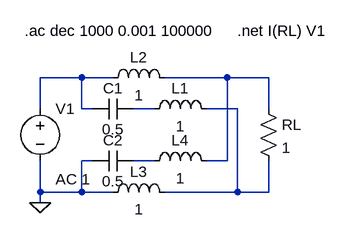
[diagram p0: schematic EJ1.asc]
EJ1.asc, the LTspice schematic file:
Version 4
SHEET 1 880 680
WIRE 96 192 32 192
WIRE 144 192 96 192
WIRE 320 192 224 192
WIRE 384 192 320 192
WIRE 32 240 32 192
WIRE 96 240 96 192
WIRE 112 240 96 240
WIRE 208 240 176 240
WIRE 336 240 288 240
WIRE 384 240 384 192
WIRE 112 320 96 320
WIRE 208 320 176 320
WIRE 320 320 320 192
WIRE 320 320 288 320
WIRE 32 368 32 320
WIRE 96 368 96 320
WIRE 96 368 32 368
WIRE 144 368 96 368
WIRE 336 368 336 240
WIRE 336 368 224 368
WIRE 384 368 384 320
WIRE 384 368 336 368
WIRE 32 384 32 368
FLAG 32 384 0
SYMBOL cap 176 224 R90
WINDOW 0 0 32 VBottom 2
WINDOW 3 32 32 VTop 2
SYMATTR InstName C1
SYMATTR Value 0.5
SYMBOL ind 192 256 R270
WINDOW 0 32 56 VTop 2
WINDOW 3 5 56 VBottom 2
SYMATTR InstName L1
SYMATTR Value 1
SYMBOL ind 128 208 R270
WINDOW 0 32 56 VTop 2
WINDOW 3 5 56 VBottom 2
SYMATTR InstName L2
SYMATTR Value 1
SYMBOL ind 128 384 R270
WINDOW 0 32 56 VTop 2
WINDOW 3 5 56 VBottom 2
SYMATTR InstName L3
SYMATTR Value 1
SYMBOL ind 192 336 R270
WINDOW 0 32 56 VTop 2
WINDOW 3 5 56 VBottom 2
SYMATTR InstName L4
SYMATTR Value 1
SYMBOL cap 176 304 R90
WINDOW 0 0 32 VBottom 2
WINDOW 3 32 32 VTop 2
SYMATTR InstName C2
SYMATTR Value 0.5
SYMBOL voltage 32 224 R0
WINDOW 123 24 124 Left 2
WINDOW 39 0 0 Left 0
SYMATTR InstName V1
SYMATTR Value ""
SYMATTR Value2 AC 1
SYMBOL res 368 224 R0
SYMATTR InstName RL
SYMATTR Value 1
TEXT 8 120 Left 2 !.ac dec 1000 0.001 100000
TEXT 336 120 Left 2 !.net I(RL) V1

The netlist it stands for:
* EJ1.asc
C1 N003 N001 0.5
L1 N003 N004 1
L2 N001 N002 1
L3 0 N004 1
L4 N005 N002 1
C2 N005 0 0.5
V1 N001 0 AC 1
RL N002 N004 1
.ac dec 1000 0.001 100000
.net I(RL) V1
.backanno
.end